# EAGLE schematic 32u4 denemesi (EAGLE 7.6.0)
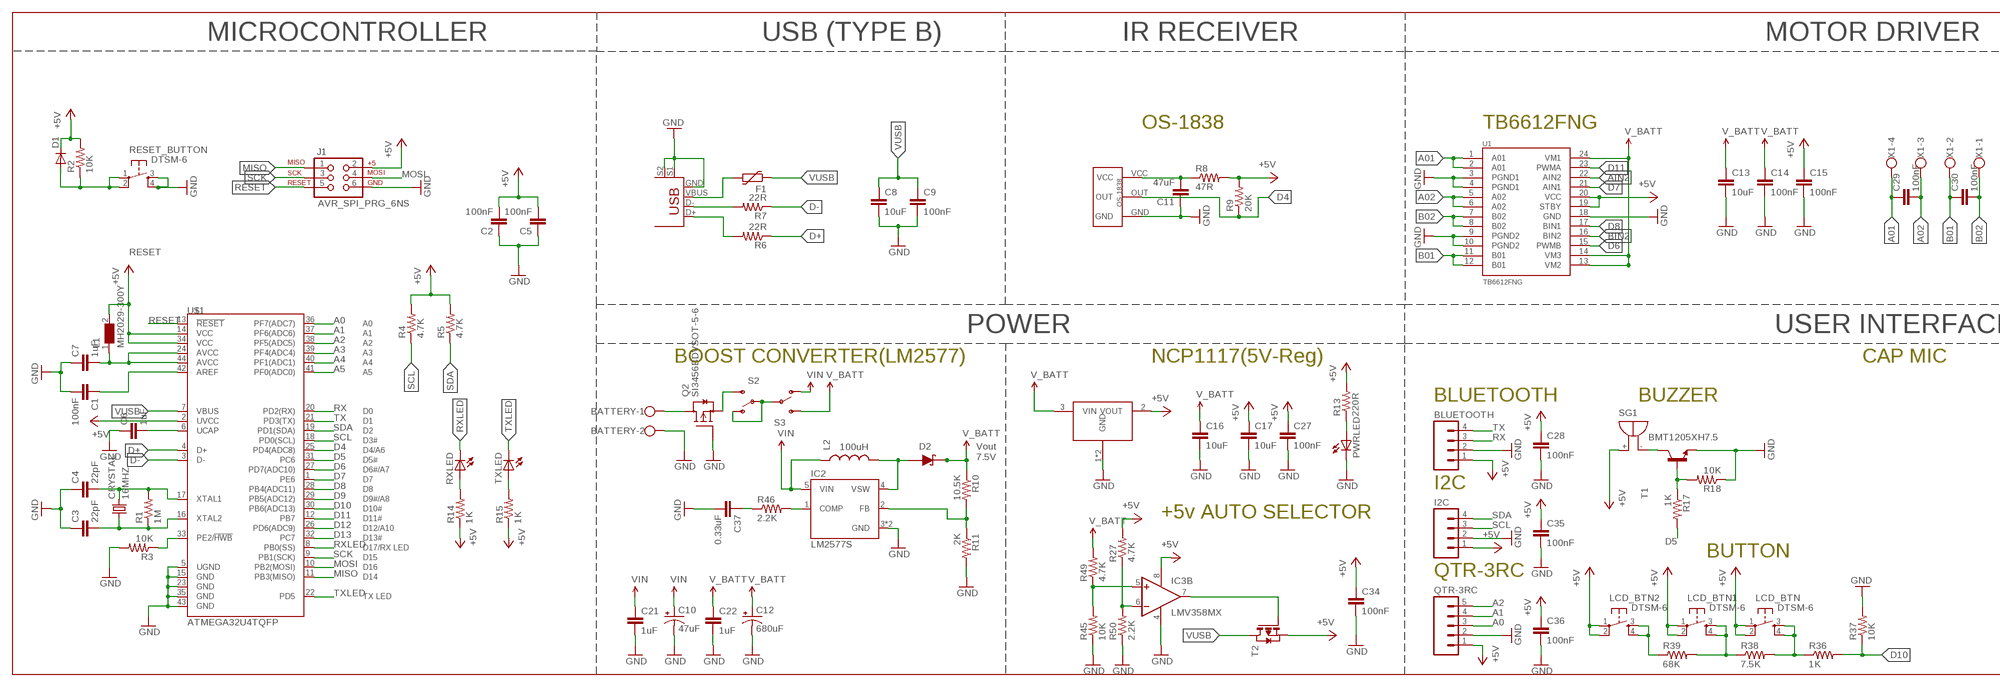
[diagram p0: schematic, sheet 1, part 1 of 2]
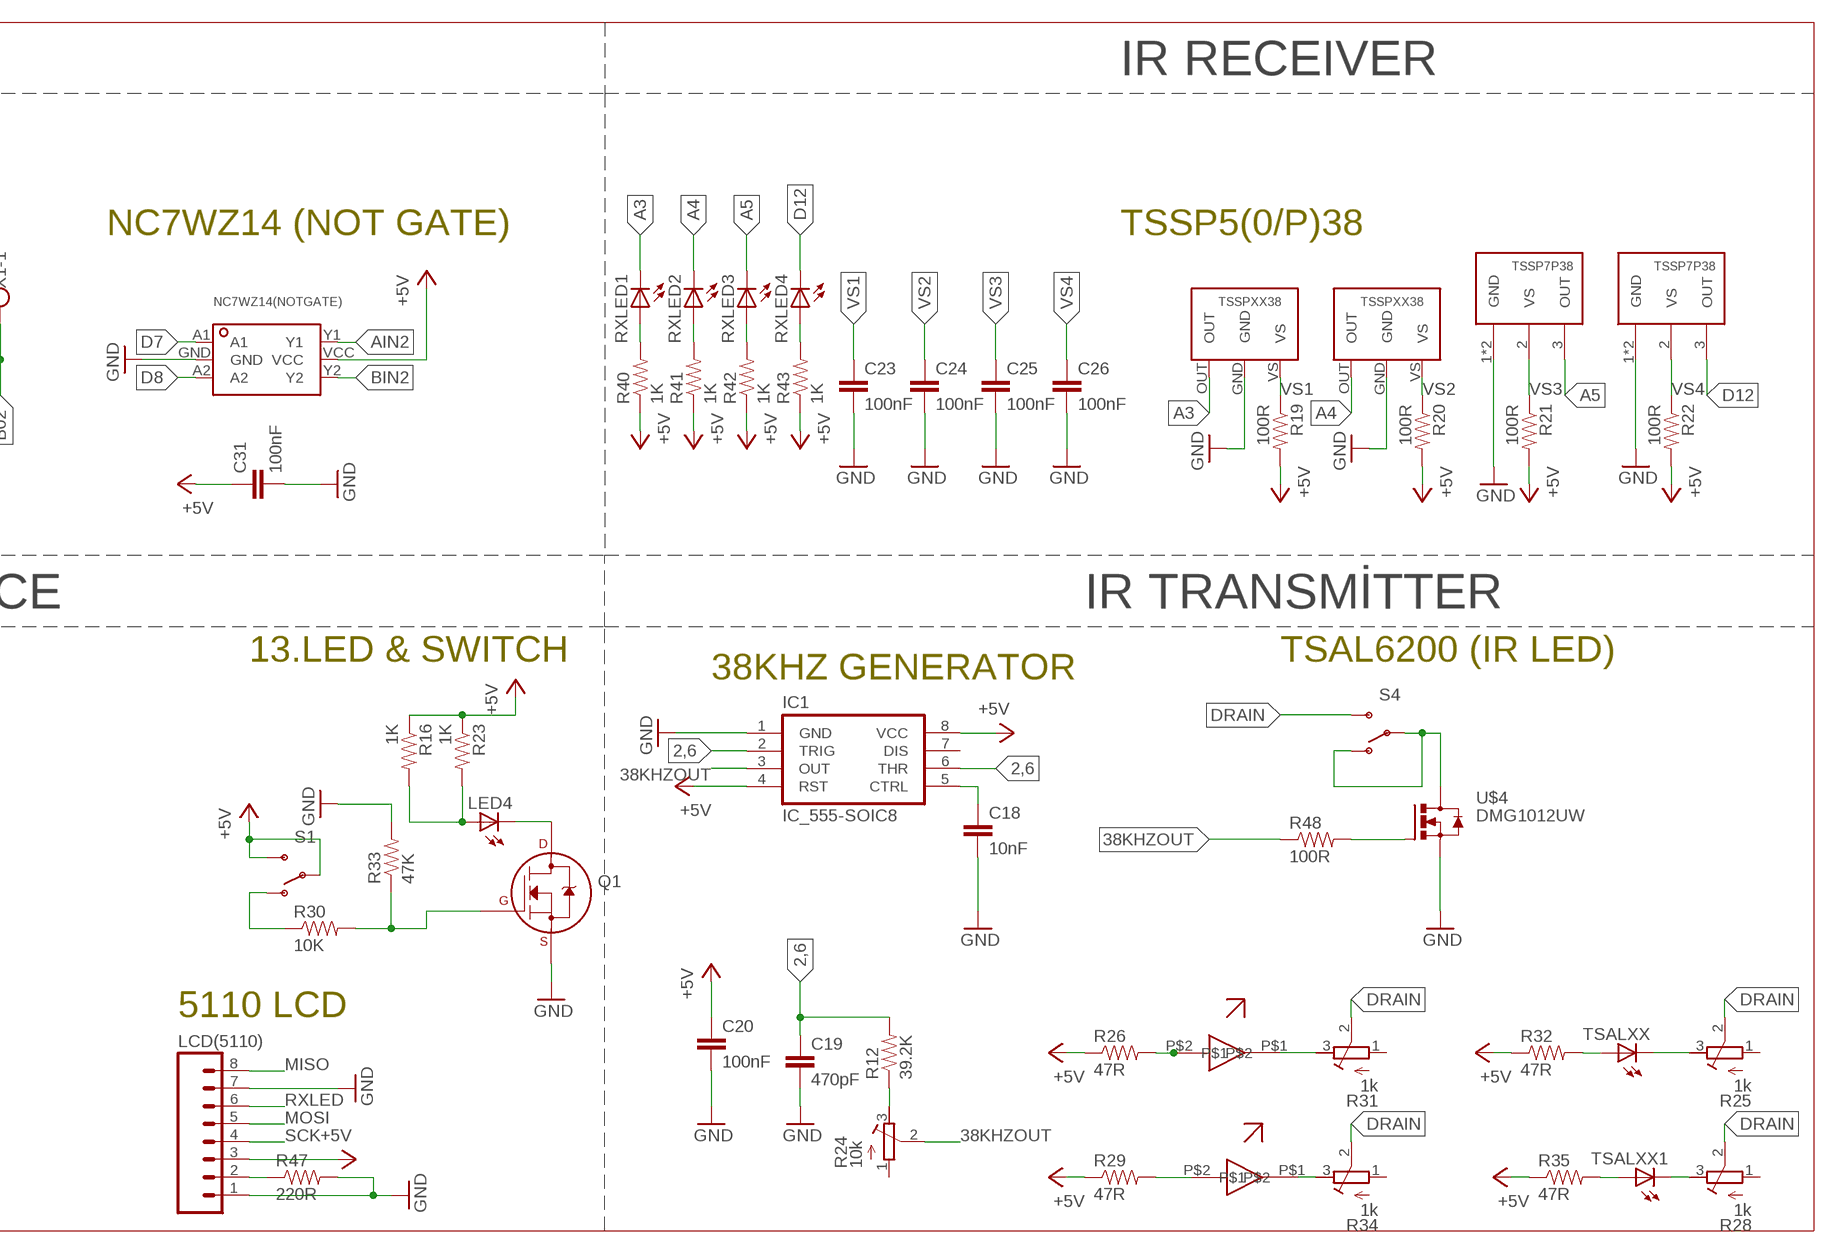
[diagram p1: schematic, sheet 1, part 2 of 2]

## Parts
BATTERY  W237-102  [W237-102]
BLUETOOTH  M04PTH  [1X04]
C1  100nF  CAP1206  [1206]
C2  100nF  CAP1206  [1206]
C3  22pF  CAP1206  [1206]
C4  22pF  CAP1206  [1206]
C5  100nF  CAP1206  [1206]
C6  1uF  CAP1206  [1206]
C7  1uF  CAP1206  [1206]
C8  10uF  CAP1206  [1206]
C9  100nF  CAP1206  [1206]
C10  47uF  CAP_POLF80  [NIPPON_F80]
C11  47uF  CAP1206  [1206]
C12  680uF  CAP_POLG  [PANASONIC_G]
C13  10uF  CAP1206  [1206]
C14  100nF  CAP1206  [1206]
C15  100nF  CAP1206  [1206]
C16  10uF  CAP1206  [1206]
C17  10uF  CAP1206  [1206]
C18  10nF  CAP1206  [1206]
C19  470pF  CAP1206  [1206]
C20  100nF  CAP1206  [1206]
C21  1uF  CAP1206  [1206]
C22  1uF  CAP1206  [1206]
C23  100nF  CAP1206  [1206]
C24  100nF  CAP1206  [1206]
C25  100nF  CAP1206  [1206]
C26  100nF  CAP1206  [1206]
C27  100nF  CAP1206  [1206]
C28  100nF  CAP1206  [1206]
C29  100nF  CAP1206  [1206]
C30  100nF  CAP1206  [1206]
C31  100nF  CAP1206  [1206]
C34  100nF  CAP1206  [1206]
C35  100nF  CAP1206  [1206]
C36  100nF  CAP1206  [1206]
C37  0.33uF  CAP1206  [1206]
CRYSTAL  16MHZ  CRYSTAL5X3  [CRYSTAL-SMD-5X3]
D1  DIODE-MINIMELF  [MINIMELF]
D2  D_SCHOTTKYA  [SMA]
F1  FUSE_PTC-0805  [PTC0805]
I2C  M04PTH  [1X04]
IC1  IC_555-SOIC8  [SOIC-8]
IC2  LM2577S  [TO263-5]
IC3  LMV358MX  [SO08]
J1  AVR_SPI_PRG_6NS  [2X3-NS]
L1  MH2029-300Y  WE-CBF_0805  [0805]
L2  INDUCTORPWR  [CDRH125]
LCD(5110)  M081X08  [1X08]
LCD_BTN  DTSM-6  [DTSM-6]
LCD_BTN1  DTSM-6  [DTSM-6]
LCD_BTN2  DTSM-6  [DTSM-6]
LED4  LEDCHIPLED_0805  [CHIPLED_0805]
PWRLED  LEDCHIPLED_0805  [CHIPLED_0805]
Q1  2N7000_SOT23  [SOT-23]
Q2  SI3456BDVSOT-5-6  [SOT23-6]
QTR-3RC  M05PTH  [1X05]
R1  1M  RESISTOR0805-RES  [0805]
R2  10K  RESISTOR0805-RES  [0805]
R3  10K  RESISTOR0805-RES  [0805]
R4  4.7K  RESISTOR0805-RES  [0805]
R5  4.7K  RESISTOR0805-RES  [0805]
R6  22R  RESISTOR0805-RES  [0805]
R7  22R  RESISTOR0805-RES  [0805]
R8  47R  RESISTOR0805-RES  [0805]
R9  20K  RESISTOR0805-RES  [0805]
R10  10.5K  RESISTOR0805-RES  [0805]
R11  2K  RESISTOR0805-RES  [0805]
R12  39.2K  RESISTOR0805-RES  [0805]
R13  220R  RESISTOR0805-RES  [0805]
R14  1K  RESISTOR0805-RES  [0805]
R15  1K  RESISTOR0805-RES  [0805]
R16  1K  RESISTOR0805-RES  [0805]
R17  1K  RESISTOR0805-RES  [0805]
R18  10K  RESISTOR0805-RES  [0805]
R19  100R  RESISTOR0805-RES  [0805]
R20  100R  RESISTOR0805-RES  [0805]
R21  100R  RESISTOR0805-RES  [0805]
R22  100R  RESISTOR0805-RES  [0805]
R23  1K  RESISTOR0805-RES  [0805]
R24  10k  R-TRIMM3296W  [RTRIM3296W]
R25  1k  R-TRIMM3296W  [RTRIM3296W]
R26  47R  RESISTOR0805-RES  [0805]
R27  4.7K  RESISTOR0805-RES  [0805]
R28  1k  R-TRIMM3296W  [RTRIM3296W]
R29  47R  RESISTOR0805-RES  [0805]
R30  10K  RESISTOR0805-RES  [0805]
R31  1k  R-TRIMM3296W  [RTRIM3296W]
R32  47R  RESISTOR0805-RES  [0805]
R33  47K  RESISTOR0805-RES  [0805]
R34  1k  R-TRIMM3296W  [RTRIM3296W]
R35  47R  RESISTOR0805-RES  [0805]
R36  1K  RESISTOR0805-RES  [0805]
R37  10K  RESISTOR0805-RES  [0805]
R38  7.5K  RESISTOR0805-RES  [0805]
R39  68K  RESISTOR0805-RES  [0805]
R40  1K  RESISTOR0805-RES  [0805]
R41  1K  RESISTOR0805-RES  [0805]
R42  1K  RESISTOR0805-RES  [0805]
R43  1K  RESISTOR0805-RES  [0805]
R45  10K  RESISTOR0805-RES  [0805]
R46  2.2K  RESISTOR0805-RES  [0805]
R47  220R  RESISTOR0805-RES  [0805]
R48  100R  RESISTOR0805-RES  [0805]
R49  4.7K  RESISTOR0805-RES  [0805]
R50  2.2K  RESISTOR0805-RES  [0805]
RESET_BUTTON  DTSM-6  [DTSM-6]
RXLED  LEDCHIPLED_0805  [CHIPLED_0805]
RXLED1  LEDCHIPLED_0805  [CHIPLED_0805]
RXLED2  LEDCHIPLED_0805  [CHIPLED_0805]
RXLED3  LEDCHIPLED_0805  [CHIPLED_0805]
RXLED4  LEDCHIPLED_0805  [CHIPLED_0805]
S1  SWITCH-SPDTPTH  [SWITCH-SPDT]
S2  SWITCH-SPDTPTH  [SWITCH-SPDT]
S3  SWITCH-SPDTPTH  [SWITCH-SPDT]
S4  SWITCH-SPDTPTH  [SWITCH-SPDT]
SG1  BMT1205XH7.5  [BMT1205XH7.5]
T1  MMBT2222ALT1-NPN-SOT23-BEC  [SOT23-BEC]
T2  PMOSSOT23  [SOT-23]
TSALXX  LED5MM  [LED5MM]
TSALXX1  LED5MM  [LED5MM]
TXLED  LEDCHIPLED_0805  [CHIPLED_0805]
U1  TB6612FNG  TB6621FNG  [SSOP24]
U$1  ATMEGA32U4TQFP  [SPARKFUN-DIGITALIC_TQFP44]
U$2  USB+SHIELD  [USB-B-PTH]
U$3  OS-1838  [OS-1838]
U$4  DMG1012UW  [SOT323]
U$5  NCP1117  [SOT223]
U$6  TSSP7P38  [TSSP7P38]
U$7  TSSP7P38  [TSSP7P38]
U$8  TSSPXX38  [TSSPXX38]
U$9  TSSPXX38  [TSSPXX38]
U$10  NC7WZ14(NOTGATE)  [SC-70-6]
U$11  IRLED  [IRLED]
U$12  IRLED  [IRLED]
X1  W237-4  [W237-4]

## Nets
2,6: C19.1 IC1.2(TRIG) IC1.6(THR) R12.2
38KHZOUT: IC1.3(OUT) R24.2(S) R48.1
+5V: BLUETOOTH.1 C2.2 C5.2 C15.1 C17.1 C20.1 C27.1 C28.1 C31.1 C34.1 C35.1 C36.1 D1.C I2C.1 IC1.4(RST) IC1.8(VCC) IC3.8(P:V+) J1.2 L1.2 LCD(5110).3 LCD_BTN1.1 LCD_BTN1.2 LCD_BTN2.1 LCD_BTN2.2 LCD_BTN.1 LCD_BTN.2 QTR-3RC.1 R2.2 R4.2 R5.2 R8.2 R9.2 R13.2 R14.1 R15.1 R16.1 R19.2 R20.2 R21.2 R22.2 R23.1 R26.1 R27.2 R29.1 R32.1 R35.1 R40.1 R41.1 R42.1 R43.1 S1.2(P) S1.3(S) SG1.+ T2.2(S) U1.19(STBY) U1.20(VCC) U$1.2(UVCC) U$1.14(VCC) U$1.34(VCC) U$5.2(VOUT) U$10.VCC
A0: QTR-3RC.3 U$1.36(PF7(ADC7))
A1: QTR-3RC.4 U$1.37(PF6(ADC6))
A01 [supply]: C29.1 U1.1(A01) U1.2(A01) X1.4
A2: QTR-3RC.5 U$1.38(PF5(ADC5))
A02 [supply]: C29.2 U1.5(A02) U1.6(A02) X1.3
A3: RXLED1.C U$1.39(PF4(ADC4)) U$9.OUT
A4: RXLED2.C U$1.40(PF1(ADC1)) U$8.OUT
A5: RXLED3.C U$1.41(PF0(ADC0)) U$6.3(OUT)
AIN2: U1.22(AIN2) U$10.Y1
B01 [supply]: C30.1 U1.11(B01) U1.12(B01) X1.2
B02 [supply]: C30.2 U1.7(B02) U1.8(B02) X1.1
BIN2: U1.16(BIN2) U$10.Y2
CTRL: C18.1 IC1.5(CTRL)
D4: R9.1 U$1.25(PD4(ADC8)) U$3.OUT
D5: R17.2 U$1.31(PC6)
D6: U1.15(PWMB) U$1.27(PD7(ADC10))
D7: U1.21(AIN1) U$1.1(PE6) U$10.A1
D8: U1.17(BIN1) U$1.28(PB4(ADC11)) U$10.A2
D9: U$1.29(PB5(ADC12))
D10: R36.2 R37.1 U$1.30(PB6(ADC13))
D11: U1.23(PWMA) U$1.12(PB7)
D12: RXLED4.C U$1.26(PD6(ADC9)) U$7.3(OUT)
D13: U$1.32(PC7)
D+: R6.1 U$1.4(D+)
D-: R7.1 U$1.3(D-)
DRAIN: R25.2(S) R28.2(S) R31.2(S) R34.2(S) S4.3(S)
GND: BATTERY.2 BLUETOOTH.2 C1.2 C2.1 C3.1 C4.1 C5.1 C6.1 C7.1 C8.2 C9.2 C10.- C11.1 C12.- C13.2 C14.2 C15.2 C16.2 C17.2 C18.2 C19.2 C20.2 C21.2 C22.2 C23.2 C24.2 C25.2 C26.2 C27.2 C28.2 C31.2 C34.2 C35.2 C36.2 C37.2 I2C.2 IC1.1(GND) IC2.3(GND) IC2.6(GND) IC3.4(P:V-) J1.6 LCD(5110).1 LCD(5110).7 PWRLED.C Q1.2(S) Q2.3(G) QTR-3RC.2 R3.2 R11.2 R18.1 R33.2 R37.2 R45.1 R47.2 R50.1 RESET_BUTTON.3 RESET_BUTTON.4 T1.E U1.3(PGND1) U1.4(PGND1) U1.9(PGND2) U1.10(PGND2) U1.18(GND) U$1.5(UGND) U$1.15(GND) U$1.23(GND) U$1.35(GND) U$1.43(GND) U$2.GND U$2.S1 U$2.S2 U$3.GND U$4.2(S) U$5.1(GND) U$5.4(GND) U$6.1(GND) U$6.4(GND) U$7.1(GND) U$7.4(GND) U$8.GND U$9.GND U$10.GND
MISO: J1.1 LCD(5110).8 U$1.11(PB3(MISO))
MOSI: J1.4 LCD(5110).5 U$1.10(PB2(MOSI))
N$1 [supply]: C7.2 L1.1 U$1.24(AVCC) U$1.44(AVCC)
N$2: C1.1 U$1.42(AREF)
N$3 [supply]: C6.2 U$1.6(UCAP)
N$4: C4.2 CRYSTAL.3 R1.2 U$1.17(XTAL1)
N$5: C3.2 CRYSTAL.1 R1.1 U$1.16(XTAL2)
N$6: F1.2 U$2.VBUS
N$7: R3.1 U$1.33(PE2/!HWB)
N$8: LCD_BTN2.3 LCD_BTN2.4 R39.1
N$9: R7.2 U$2.D-
N$10: R6.2 U$2.D+
N$11: IC3.5(B:+IN) R45.2 R49.1
N$12: C11.2 R8.1 U$3.VCC
N$14: PWRLED.A R13.1
N$15 [supply]: IC2.2(FB) R10.2 R11.1
N$16: R48.2 U$4.1(G)
N$17: LCD_BTN.3 LCD_BTN.4 R36.1 R38.2
N$18: LCD_BTN1.3 LCD_BTN1.4 R38.1 R39.2
N$21: R40.2 RXLED1.A
N$22: R14.2 RXLED.A
N$23: R15.2 TXLED.A
N$24: LED4.A R16.2 R23.2
N$25: R17.1 R18.2 T1.B
N$26: IC3.6(B:-IN) R27.1 R50.2
N$27: SG1.- T1.C
N$28: IC3.7(B:OUT) T2.3(G)
N$29: R12.1 R24.3(A)
N$30: R41.2 RXLED2.A
N$31: S4.1(O) S4.2(P) U$4.3(D)
N$33: R25.3(A) TSALXX.K(C)
N$34: R32.2 TSALXX.A
N$35: LED4.C Q1.3(D)
N$37: R28.3(A) TSALXX1.K(C)
N$38: R35.2 TSALXX1.A
N$39: R30.1 S1.1(O)
N$40: Q1.1(G) R30.2 R33.1
N$41: R31.3(A) U$11.P$1
N$42: R26.2 U$11.P$2
N$45: R34.3(A) U$12.P$1
N$46: R29.2 U$12.P$2
N$49: BATTERY.1 Q2.1(D) Q2.2(D) Q2.5(D) Q2.6(D)
N$50: R42.2 RXLED3.A
N$51: Q2.4(S) S2.3(S)
N$52 [supply]: IC2.1(COMP) R46.2
N$53: C37.1 R46.1
N$54 [supply]: S2.1(O) S2.2(P) S3.2(P)
N$55: LCD(5110).2 R47.1
N$56: R43.2 RXLED4.A
RESET: D1.A J1.5 R2.1 RESET_BUTTON.1 RESET_BUTTON.2 U$1.13(!RESET)
RX: BLUETOOTH.3 U$1.20(PD2(RX))
RXLED: LCD(5110).6 RXLED.C U$1.8(PB0(SS))
SCK: J1.3 LCD(5110).4 U$1.9(PB1(SCK))
SCL: I2C.3 R4.1 U$1.18(PD0(SCL))
SDA: I2C.4 R5.1 U$1.19(PD1(SDA))
TX: BLUETOOTH.4 U$1.21(PD3(TX))
TXLED: TXLED.C U$1.22(PD5)
V_BATT [supply]: C12.+ C13.1 C14.1 C16.1 C22.1 D2.1(C) R10.1 R49.2 S3.3(S) U1.13(VM2) U1.14(VM3) U1.24(VM1) U$5.3(VIN)
VIN [supply]: C10.+ C21.1 IC2.5(VIN) L2.1 S3.1(O)
VS1: C23.1 R19.1 U$9.VS
VS2: C24.1 R20.1 U$8.VS
VS3: C25.1 R21.1 U$6.2(VS)
VS4: C26.1 R22.1 U$7.2(VS)
VSW [supply]: D2.2(A) IC2.4(VSW) L2.2
VUSB [supply]: C8.1 C9.1 F1.1 T2.1(D) U$1.7(VBUS)
Unconnected: IC1.7(DIS) IC3.1(A:OUT) IC3.2(A:-IN) IC3.3(A:+IN) R24.1(E) R25.1(E) R28.1(E) R31.1(E) R34.1(E)

## Notes on the sheet
- MICROCONTROLLER | USB (TYPE B) | IR RECEIVER | MOTOR DRIVER | IR RECEIVER
- OS-1838 | TB6612FNG | NC7WZ14 (NOT GATE) | TSSP5(0/P)38
- POWER | USER INTERFACE | IR TRANSMİTTER
- BOOST CONVERTER(LM2577) | NCP1117(5V-Reg) | CAP MIC | 13.LED & SWITCH | TSAL6200 (IR LED)
- 38KHZ GENERATOR
- BLUETOOTH | BUZZER
- 100uH
- Vout
  7.5V
- I2C
- +5v AUTO SELECTOR
- BUTTON | 5110 LCD
- QTR-3RC

## Library data of the parts
BATTERY = con-wago-500:W237-102: WAGO SCREW CLAMP; MPN: 237-102; OC_FARNELL: unknown; OC_NEWARK: 70K9898
BLUETOOTH I2C = SparkFun-Connectors:M04: Header 4 Standard 4-pin 0.1" header. Use with straight break away headers (SKU : PRT-00116), right angle break away headers (PRT-00553), swiss pins (PRT-00743), machine pins (PRT-00117), and female headers (PRT-00115). Molex polarized connector foot print use with SKU : PRT-08231 with associated crimp pins and housings. 1MM SMD Version SKU: PRT-10208
C1-C9 C11 C13-C31 C34-C37 = SparkFun-Passives:CAP: Capacitor Standard 0603 ceramic capacitor, and 0.1" leaded capacitor.
C10 C12 = SparkFun-Passives:CAP_POL: Capacitor Polarized These are standard SMD and PTH capacitors. Normally 10uF, 47uF, and 100uF in electrolytic and tantalum varieties. Always verify the external diameter of the through hole cap, it varies with capacity, voltage, and manufacturer. The EIA devices should be standard.
CRYSTAL = SparkFun-FreqCtrl:CRYSTAL: Various standard crystals. Proven footprints. Spark Fun Electronics SKU : COM-00534
D1 = diode:DIODE-: DIODE
D2 = m-pad-2.1:D_SCHOTTKY: Schottky diodes in various packages
F1 = dp_devices:FUSE_PTC: Resettable PTC
IC1 = dp_devices:IC_555: Classic 555 IC
IC2 = v-reg-3:LM2577: National Semiconductor <http://www.national.com> 3.0A Step-Up "Simple Switcher"(c) 3.0A 65V NPN switch, step-up regulator
IC3 = linear:LMV358?*: Dual General Purpose, Low Voltage, Rail-to-Rail Output Operational Amplifiers Source: http://www.national.com/mpf/LM/LMV321.html http://www.national.com/dt/lmv_qual.pdf
J1 = SparkFun-Connectors:AVR_SPI_PRG_6: AVR ISP 6 Pin This is the reduced ISP connector for AVR programming. Common on Arduino. This footprint will take up less PCB space and can be used with a 10-pin to 6-pin adapter such as SKU: BOB-08508
L1 = wuerth_elektronik_v5:WE-CBF: SMD EMI Suppression Ferrite Beads - excellent anti-EMI properties - low DCR - impedances till 3000 ohms - rated current up to 6 A
L2 = SparkFun-Passives:INDUCTOR: Inductors Basic Inductor/Choke - 0603 and 1206. Footprints are not proven and vary greatly between part numbers. SRN6045- 33uH, 20% 1.4A SDR0403-560KL - 56uH, 10%, 500mA RMS/740mA peak
LCD(5110) = SparkFun-Connectors:M08: Header 8 Standard 8-pin 0.1" header. Use with straight break away headers (SKU : PRT-00116), right angle break away headers (PRT-00553), swiss pins (PRT-00743), machine pins (PRT-00117), and female headers (PRT-00115).
LCD_BTN LCD_BTN1 LCD_BTN2 RESET_BUTTON = switch-tact:DTSM-6
LED4 PWRLED RXLED RXLED1-RXLED4 TSALXX TSALXX1 TXLED = led:LED: LED OSRAM: - CHIPLED LG R971, LG N971, LY N971, LG Q971, LY Q971, LO R971, LY R971 LH N974, LH R974 LS Q976, LO Q976, LY Q976 LO Q996 - Hyper CHIPLED LW Q18S LB Q993, LB Q99A, LB R99A - SideLED LS A670, LO A670, LY A670, LG A670, LP A670 LB A673, LV A673, LT A673, LW A673 LH A674 LY A675 LS A676, LA A676, LO A676, LY A676, LW A676 LS A679, LY A679, LG A679 - Hyper Micro SIDELED® LS Y876, LA Y876, LO Y876, LY Y876 LT Y87S - SmartLED LW L88C, LW L88S LB L89C, LB L89S, LG L890 LS L89K, LO L89K, LY L89K LS L896, LA L896, LO L896, LY L896 - TOPLED LS T670, LO T670, LY T670, LG T670, LP T670 LSG T670, LSP T670, LSY T670, LOP T670, LYG T670 LG T671, LOG T671, LSG T671 LB T673, LV T673, LT T673, LW T673 LH T674 LS T676, LA T676, LO T676, LY T676, LB T676, LH T676, LSB T676, LW T676 LB T67C, LV T67C, LT T67C, LS T67K, LO T67K, LY T67K, LW E67C LS E67B, LA E67B, LO E67B, LY E67B, LB E67C, LV E67C, LT E67C LW T67C LS T679, LY T679, LG T679 LS T770, LO T770, LY T770, LG T770, LP T770 LB T773, LV T773, LT T773, LW T773 LH T774 LS E675, LA E675, LY E675, LS T675 LS T776, LA T776, LO T776, LY T776, LB T776 LHGB T686 LT T68C, LB T68C - Hyper Mini TOPLED® LB M676 - Mini TOPLED Santana® LG M470 LS M47K, LO M47K, LY M47K Source: http://www.osram.convergy.de LUXEON: - LUMILED® LXK2-PW12-R00, LXK2-PW12-S00, LXK2-PW14-U00, LXK2-PW14-V00 LXK2-PM12-R00, LXK2-PM12-S00, LXK2-PM14-U00 LXK2-PE12-Q00, LXK2-PE12-R00, LXK2-PE12-S00, LXK2-PE14-T00, LXK2-PE14-U00 LXK2-PB12-K00, LXK2-PB12-L00, LXK2-PB12-M00, LXK2-PB14-N00, LXK2-PB14-P00, LXK2-PB14-Q00 LXK2-PR12-L00, LXK2-PR12-M00, LXK2-PR14-Q00, LXK2-PR14-R00 LXK2-PD12-Q00, LXK2-PD12-R00, LXK2-PD12-S00 LXK2-PH12-R00, LXK2-PH12-S00 LXK2-PL12-P00, LXK2-PL12-Q00, LXK2-PL12-R00 Source: www.luxeon.com KINGBRIGHT: KA-3528ASYC Source: www.kingbright.com
Q1 = transistors:2N700*: 2N7000, 2N7002, NDS7002A N-channel enhancement mode MOSFET
Q2 = m-pad-2.1:SI3456BDV: Vishay Siliconix Si3456BDVY N-Channel 30-V (D-S) MOSFET FEATURES: TrenchFET Power MOSFET 100% Rg Tested Please send any comments to: messi@users.sourceforge.net
QTR-3RC = SparkFun-Connectors:M05: Header 5 Standard 5-pin 0.1" header. Use with straight break away headers (SKU : PRT-00116), right angle break away headers (PRT-00553), swiss pins (PRT-00743), machine pins (PRT-00117), and female headers (PRT-00115). Molex polarized connector foot print use with SKU : PRT-08230 with associated crimp pins and housings.
R1-R23 R26 R27 R29 R30 R32 R33 R35-R43 R45-R50 = SparkFun-Resistors:RESISTOR: Resistor Basic schematic elements and footprints for 0603, 1206, and PTH resistors.
R24 R25 R28 R31 R34 = resistor:R-TRIMM: Trimm resistor
S1-S4 = SparkFun-Electromechanical:SWITCH-SPDT: SPDT Switch Simple slide switch, Spark Fun Electronics SKU : COM-00102 DPDT SMT slide switch, AYZ0202, SWCH-08179
SG1 = buzzer:BMT1205XH7.5: MAGNETIC TRANSDUCER Source: Http:www.be-star.com; OC_FARNELL: unknown; OC_NEWARK: unknown
T1 = transistor:*-NPN-: NPN Transistror BF959 corrected 2008.03.06
T2 = zetex:PMOSSOT23: MOS FET; OC_FARNELL: unknown; OC_NEWARK: unknown
U1 = SparkFun-PowerIC:TB6621FNG: Toshiba 1A dual motor driver IC-09363; PROD_ID: IC-09363
U$1 = SparkFun-DigitalIC:ATMEGA32U4: Atmel 44-pin 8-bit Microcontroller with 32KBytes of ISP Flash and USB Controller ----- Please use the QFN-44-NOPAD_1:1 package for the footprint of all boards using a 32U4. Route traces directly away from the pads as much as possible.; PROD_ID: IC-11161
U$2 = SparkFun-Connectors:USB+SHIELD: USB+Shield USB connector with shield pins connectable
U$3 = HACIBİDEAS:OS-1838
U$4 = m-pad-2.1:DMG1012UW
U$5 = SparkFun-PowerIC:NCP1117
U$6 U$7 = HACIBİDEAS:TSSP7P38
U$8 U$9 = HACIBİDEAS:TSSPXX38
U$10 = m-pad-2.1:NC7WZ14(NOTGATE)
U$11 U$12 = HACIBİDEAS:IRLED
X1 = con-wago-500:W237-4: WAGO SCREW CLAMP; OC_FARNELL: unknown; OC_NEWARK: unknown

## Net classes
0 default: width 0.406 mm, drill 0.254 mm, clearance 0.203 mm
1 supply: width 0.406 mm, drill 0.254 mm, clearance 0.203 mm